# EAGLE design power_hub (EAGLE 9.6.2)
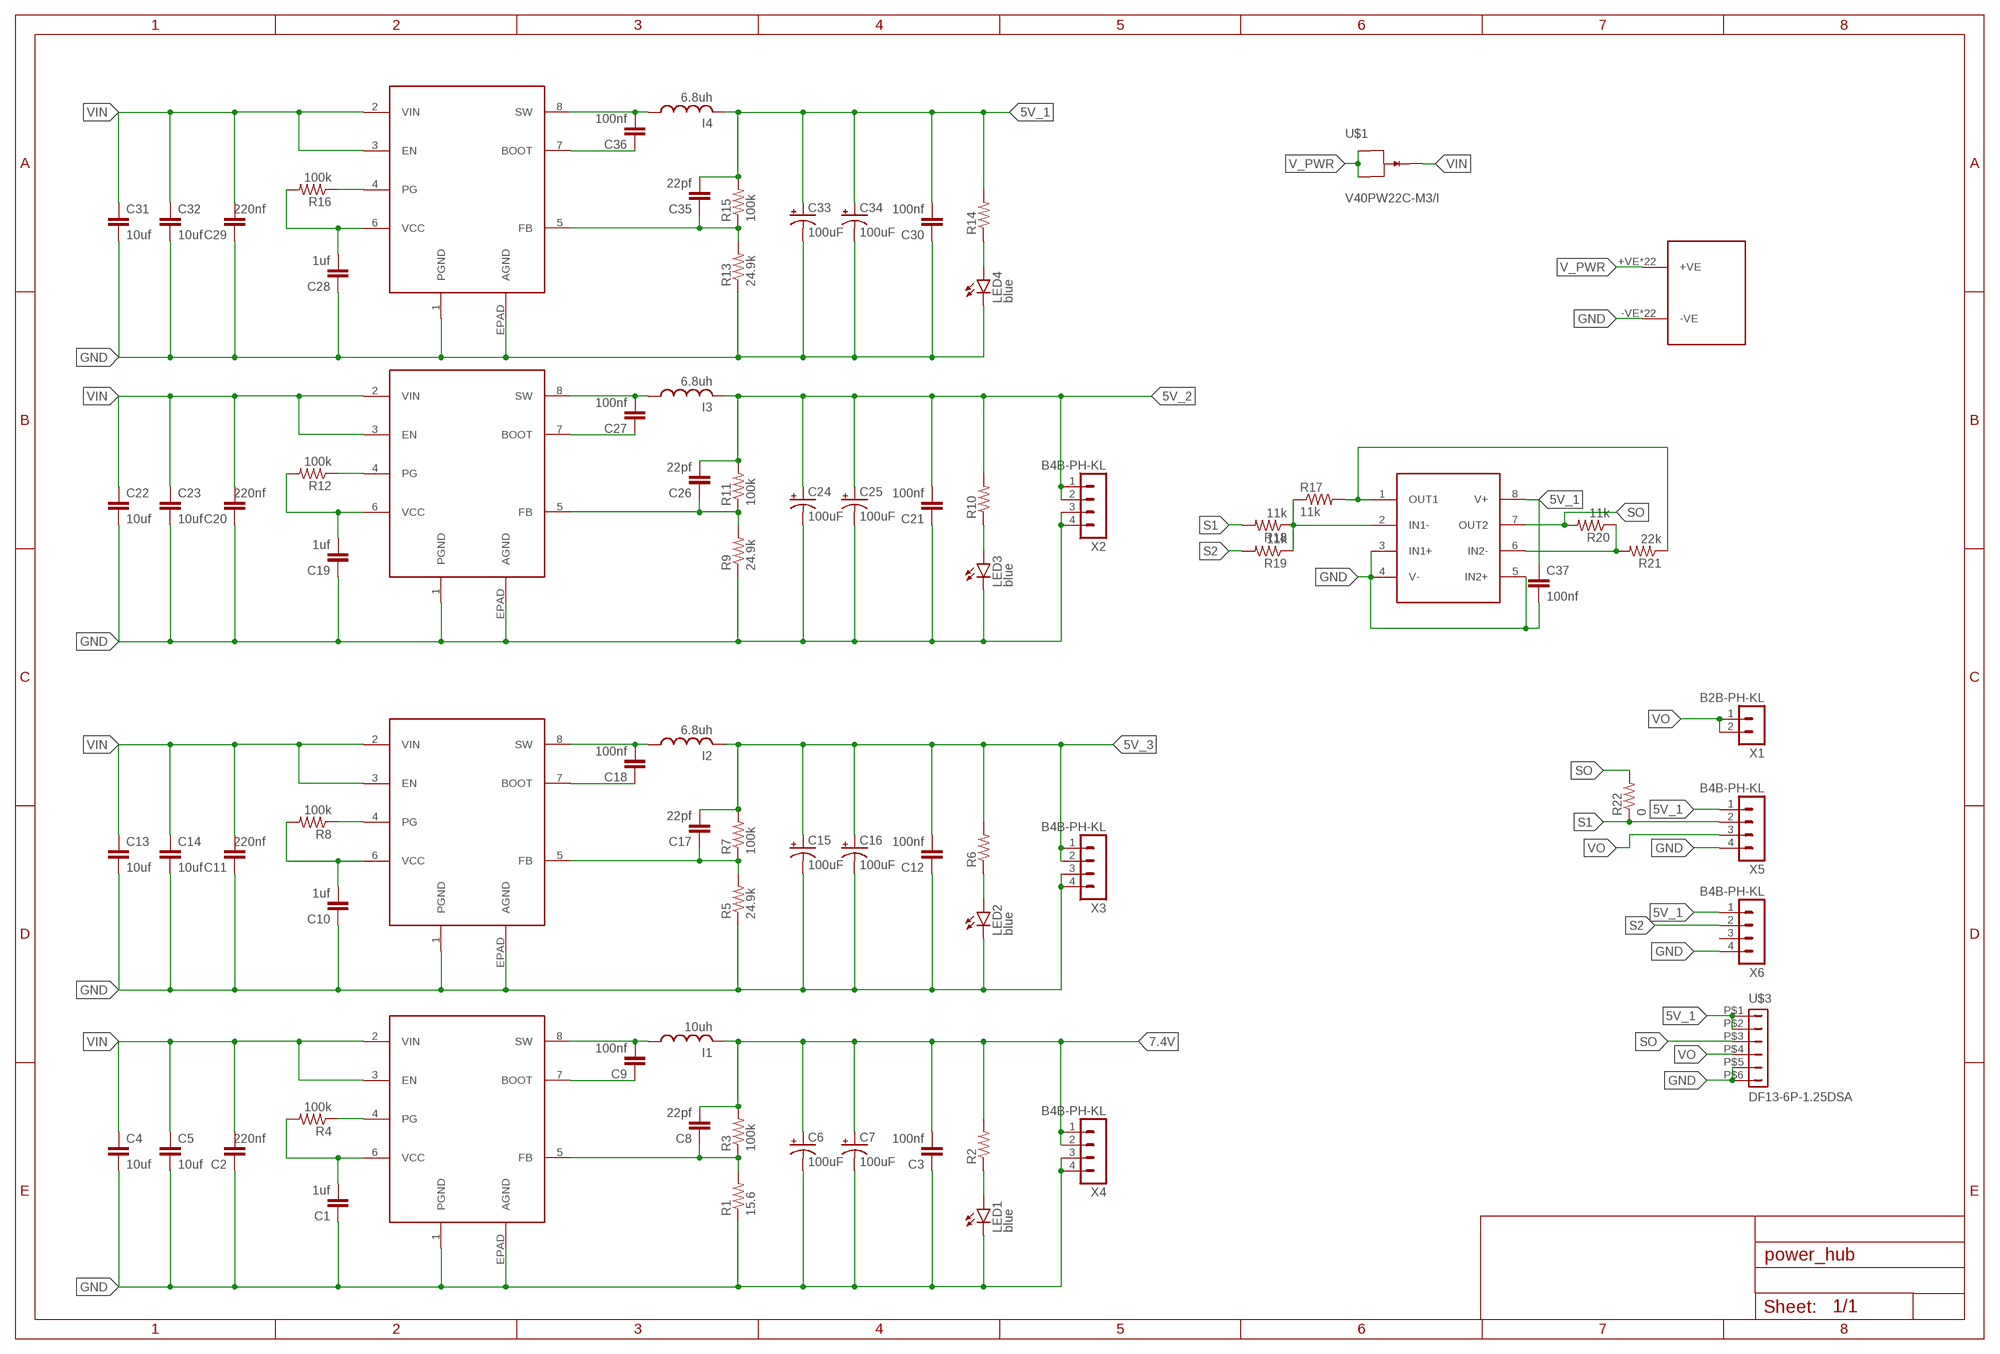
[diagram p0: schematic, sheet 1]

## Parts
C1  1uf  C-EUC0805  [C0805]
C2  220nf  C-EUC0805  [C0805]
C3  100nf  C-EUC0805  [C0805]
C4  10uf  C-EUC1210  [C1210]
C5  10uf  C-EUC1210  [C1210]
C6  100uF  100UF-POLAR-25V-20%(ELEC)  [PANASONIC_D]
C7  100uF  100UF-POLAR-25V-20%(ELEC)  [PANASONIC_D]
C8  22pf  C-EUC0805  [C0805]
C9  100nf  C-EUC0805  [C0805]
C10  1uf  C-EUC0805  [C0805]
C11  220nf  C-EUC0805  [C0805]
C12  100nf  C-EUC0805  [C0805]
C13  10uf  C-EUC1210  [C1210]
C14  10uf  C-EUC1210  [C1210]
C15  100uF  100UF-POLAR-25V-20%(ELEC)  [PANASONIC_D]
C16  100uF  100UF-POLAR-25V-20%(ELEC)  [PANASONIC_D]
C17  22pf  C-EUC0805  [C0805]
C18  100nf  C-EUC0805  [C0805]
C19  1uf  C-EUC0805  [C0805]
C20  220nf  C-EUC0805  [C0805]
C21  100nf  C-EUC0805  [C0805]
C22  10uf  C-EUC1210  [C1210]
C23  10uf  C-EUC1210  [C1210]
C24  100uF  100UF-POLAR-25V-20%(ELEC)  [PANASONIC_D]
C25  100uF  100UF-POLAR-25V-20%(ELEC)  [PANASONIC_D]
C26  22pf  C-EUC0805  [C0805]
C27  100nf  C-EUC0805  [C0805]
C28  1uf  C-EUC0805  [C0805]
C29  220nf  C-EUC0805  [C0805]
C30  100nf  C-EUC0805  [C0805]
C31  10uf  C-EUC1210  [C1210]
C32  10uf  C-EUC1210  [C1210]
C33  100uF  100UF-POLAR-25V-20%(ELEC)  [PANASONIC_D]
C34  100uF  100UF-POLAR-25V-20%(ELEC)  [PANASONIC_D]
C35  22pf  C-EUC0805  [C0805]
C36  100nf  C-EUC0805  [C0805]
C37  100nf  C-EUC0805  [C0805]
I1  10uh  INDUCTORINDUCTOR-1265  [INDUCTOR-1265]
I2  6.8uh  INDUCTORINDUCTOR-1265  [INDUCTOR-1265]
I3  6.8uh  INDUCTORINDUCTOR-1265  [INDUCTOR-1265]
I4  6.8uh  INDUCTORINDUCTOR-1265  [INDUCTOR-1265]
LED1  blue  LEDCHIPLED_0805  [CHIPLED_0805]
LED2  blue  LEDCHIPLED_0805  [CHIPLED_0805]
LED3  blue  LEDCHIPLED_0805  [CHIPLED_0805]
LED4  blue  LEDCHIPLED_0805  [CHIPLED_0805]
R1  15.6  R-US_R0805  [R0805]
R2  1k  R-US_R0805  [R0805]
R3  100k  R-US_R0805  [R0805]
R4  100k  R-US_R0805  [R0805]
R5  24.9k  R-US_R0805  [R0805]
R6  1k  R-US_R0805  [R0805]
R7  100k  R-US_R0805  [R0805]
R8  100k  R-US_R0805  [R0805]
R9  24.9k  R-US_R0805  [R0805]
R10  1k  R-US_R0805  [R0805]
R11  100k  R-US_R0805  [R0805]
R12  100k  R-US_R0805  [R0805]
R13  24.9k  R-US_R0805  [R0805]
R14  1k  R-US_R0805  [R0805]
R15  100k  R-US_R0805  [R0805]
R16  100k  R-US_R0805  [R0805]
R17  11k  R-US_R0805  [R0805]
R18  11k  R-US_R0805  [R0805]
R19  11k  R-US_R0805  [R0805]
R20  11k  R-US_R0805  [R0805]
R21  22k  R-US_R0805  [R0805]
R22  0  R-US_R0805  [R0805]
U1  LMR33640  [SO-POWERPAD8_DDA_TEX-M]
U2  LMR33640  [SO-POWERPAD8_DDA_TEX-M]
U3  LMR33640  [SO-POWERPAD8_DDA_TEX-M]
U4  LMR33640  [SO-POWERPAD8_DDA_TEX-M]
U$1  V40PW22C-M3/I  DIODE-TO252  [TO-252AE]
U$2  LM3588  [SOP-08]
U$3  DF13-6P-1.25DSA  [DF13-6P-1.25DSA]
U$4  CON_PAD  [MOTOR_PAD]
X1  B2B-PH-KL  [B2B-PH-K-S]
X2  B4B-PH-KL  [B4B-PH-K-S]
X3  B4B-PH-KL  [B4B-PH-K-S]
X4  B4B-PH-KL  [B4B-PH-K-S]
X5  B4B-PH-KL  [B4B-PH-K-S]
X6  B4B-PH-KL  [B4B-PH-K-S]

## Nets
5V_1: C30.2 C33.+ C34.+ C35.2 C37.1 I4.P$2 R14.2 R15.2 U$2.8(V+) U$3.P$1 U$3.P$2 X5.1 X6.1
5V_2: C21.2 C24.+ C25.+ C26.2 I3.P$2 R10.2 R11.2 X2.1 X2.2
5V_3: C12.2 C15.+ C16.+ C17.2 I2.P$2 R6.2 R7.2 X3.1 X3.2
7.4V: C3.2 C6.+ C7.+ C8.2 I1.P$2 R2.2 R3.2 X4.1 X4.2
GND: C1.1 C2.1 C3.1 C4.2 C5.2 C6.- C7.- C10.1 C11.1 C12.1 C13.2 C14.2 C15.- C16.- C19.1 C20.1 C21.1 C22.2 C23.2 C24.- C25.- C28.1 C29.1 C30.1 C31.2 C32.2 C33.- C34.- C37.2 LED1.C LED2.C LED3.C LED4.C R1.1 R5.1 R9.1 R13.1 U1.1(PGND) U1.EPAD(AGND) U2.1(PGND) U2.EPAD(AGND) U3.1(PGND) U3.EPAD(AGND) U4.1(PGND) U4.EPAD(AGND) U$2.3(IN1+) U$2.4(V-) U$2.5(IN2+) U$3.P$5 U$3.P$6 U$4.-VE U$4.-VE_1(-VE) U$4.V37(-VE) U$4.V38(-VE) U$4.V39(-VE) U$4.V40(-VE) U$4.V41(-VE) U$4.V42(-VE) U$4.V43(-VE) U$4.V44(-VE) U$4.V45(-VE) U$4.V46(-VE) U$4.V47(-VE) U$4.V48(-VE) U$4.V49(-VE) U$4.V50(-VE) U$4.V51(-VE) U$4.V52(-VE) U$4.V53(-VE) U$4.V54(-VE) U$4.V55(-VE) U$4.V56(-VE) X2.3 X2.4 X3.3 X3.4 X4.3 X4.4 X5.4 X6.4
N$1: R17.1 R18.1 R19.1 U$2.2(IN1-)
N$2: R20.1 R21.2 U$2.6(IN2-)
N$5: R17.2 R21.1 U$2.1(OUT1)
N$6: C36.1 U4.7(BOOT)
N$8: C36.2 I4.P$1 U4.8(SW)
N$9: C35.1 R13.2 R15.1 U4.5(FB)
N$10: C28.2 R16.2 U4.6(VCC)
N$11: R16.1 U4.4(PG)
N$12: LED4.A R14.1
N$13: C18.1 U2.7(BOOT)
N$14: C18.2 I2.P$1 U2.8(SW)
N$15: C17.1 R5.2 R7.1 U2.5(FB)
N$16: C10.2 R8.2 U2.6(VCC)
N$17: R8.1 U2.4(PG)
N$18: LED2.A R6.1
N$19: C27.1 U3.7(BOOT)
N$20: C27.2 I3.P$1 U3.8(SW)
N$21: C26.1 R9.2 R11.1 U3.5(FB)
N$22: C19.2 R12.2 U3.6(VCC)
N$23: R12.1 U3.4(PG)
N$24: LED3.A R10.1
N$25: C9.1 U1.7(BOOT)
N$26: C9.2 I1.P$1 U1.8(SW)
N$27: C8.1 R1.2 R3.1 U1.5(FB)
N$28: C1.2 R4.2 U1.6(VCC)
N$29: R4.1 U1.4(PG)
N$30: LED1.A R2.1
S1: R18.2 R22.1 X5.2
S2: R19.2 X6.2
SO: R20.2 R22.2 U$2.7(OUT2) U$3.P$3
V_PWR: U$1.P$2(A1) U$1.P$3(A2) U$4.+VE U$4.+VE_1(+VE) U$4.V7(+VE) U$4.V8(+VE) U$4.V9(+VE) U$4.V10(+VE) U$4.V11(+VE) U$4.V12(+VE) U$4.V13(+VE) U$4.V14(+VE) U$4.V15(+VE) U$4.V16(+VE) U$4.V17(+VE) U$4.V18(+VE) U$4.V19(+VE) U$4.V20(+VE) U$4.V21(+VE) U$4.V22(+VE) U$4.V23(+VE) U$4.V24(+VE) U$4.V25(+VE) U$4.V26(+VE)
VIN: C2.2 C4.1 C5.1 C11.2 C13.1 C14.1 C20.2 C22.1 C23.1 C29.2 C31.1 C32.1 U1.2(VIN) U1.3(EN) U2.2(VIN) U2.3(EN) U3.2(VIN) U3.3(EN) U4.2(VIN) U4.3(EN) U$1.P$1(K)
VO: U$3.P$4 X1.1 X1.2 X5.3
Unconnected: X6.3

## Library data of the parts
C1-C5 C8-C14 C17-C23 C26-C32 C35-C37 = rcl:C-EU: CAPACITOR, European symbol; SPICEPREFIX: C
C6 C7 C15 C16 C24 C25 C33 C34 = SparkFun-Capacitors:100UF-POLAR: 100µF polarized capacitors A capacitor is a passive two-terminal electrical component used to store electrical energy temporarily in an electric field.; PROD_ID: CAP-12547
I1-I4 = pcbV1:INDUCTOR
LED1-LED4 = led:LED: LED OSRAM: - CHIPLED LG R971, LG N971, LY N971, LG Q971, LY Q971, LO R971, LY R971 LH N974, LH R974 LS Q976, LO Q976, LY Q976 LO Q996 - Hyper CHIPLED LW Q18S LB Q993, LB Q99A, LB R99A - SideLED LS A670, LO A670, LY A670, LG A670, LP A670 LB A673, LV A673, LT A673, LW A673 LH A674 LY A675 LS A676, LA A676, LO A676, LY A676, LW A676 LS A679, LY A679, LG A679 - Hyper Micro SIDELED® LS Y876, LA Y876, LO Y876, LY Y876 LT Y87S - SmartLED LW L88C, LW L88S LB L89C, LB L89S, LG L890 LS L89K, LO L89K, LY L89K LS L896, LA L896, LO L896, LY L896 - TOPLED LS T670, LO T670, LY T670, LG T670, LP T670 LSG T670, LSP T670, LSY T670, LOP T670, LYG T670 LG T671, LOG T671, LSG T671 LB T673, LV T673, LT T673, LW T673 LH T674 LS T676, LA T676, LO T676, LY T676, LB T676, LH T676, LSB T676, LW T676 LB T67C, LV T67C, LT T67C, LS T67K, LO T67K, LY T67K, LW E67C LS E67B, LA E67B, LO E67B, LY E67B, LB E67C, LV E67C, LT E67C LW T67C LS T679, LY T679, LG T679 LS T770, LO T770, LY T770, LG T770, LP T770 LB T773, LV T773, LT T773, LW T773 LH T774 LS E675, LA E675, LY E675, LS T675 LS T776, LA T776, LO T776, LY T776, LB T776 LHGB T686 LT T68C, LB T68C - Hyper Mini TOPLED® LB M676 - Mini TOPLED Santana® LG M470 LS M47K, LO M47K, LY M47K Source: http://www.osram.convergy.de LUXEON: - LUMILED® LXK2-PW12-R00, LXK2-PW12-S00, LXK2-PW14-U00, LXK2-PW14-V00 LXK2-PM12-R00, LXK2-PM12-S00, LXK2-PM14-U00 LXK2-PE12-Q00, LXK2-PE12-R00, LXK2-PE12-S00, LXK2-PE14-T00, LXK2-PE14-U00 LXK2-PB12-K00, LXK2-PB12-L00, LXK2-PB12-M00, LXK2-PB14-N00, LXK2-PB14-P00, LXK2-PB14-Q00 LXK2-PR12-L00, LXK2-PR12-M00, LXK2-PR14-Q00, LXK2-PR14-R00 LXK2-PD12-Q00, LXK2-PD12-R00, LXK2-PD12-S00 LXK2-PH12-R00, LXK2-PH12-S00 LXK2-PL12-P00, LXK2-PL12-Q00, LXK2-PL12-R00 Source: www.luxeon.com KINGBRIGHT: KA-3528ASYC Source: www.kingbright.com
R1-R22 = rcl:R-US_: RESISTOR, American symbol; SPICEPREFIX: R
U1-U4 = LMR33640:LMR33640
U$1 = diode-to252:DIODE-TO252
U$2 = LM358:LM3588
U$3 = con-hirose-df13:DF13-6P-1.25: DF13-6P 1.25mm Pitch Miniature Crimping Connector.
U$4 = power_pad:CON_PAD
X1 = con-JST PH:B2B-PH: JST PH series header 2.00mm pitch disconnectable crimp style connectors, vertical (side entry type), 2 pins
X2-X6 = con-JST PH:B4B-PH: JST PH series header 2.00mm pitch disconnectable crimp style connectors, vertical (side entry type), 4 pins

## Board
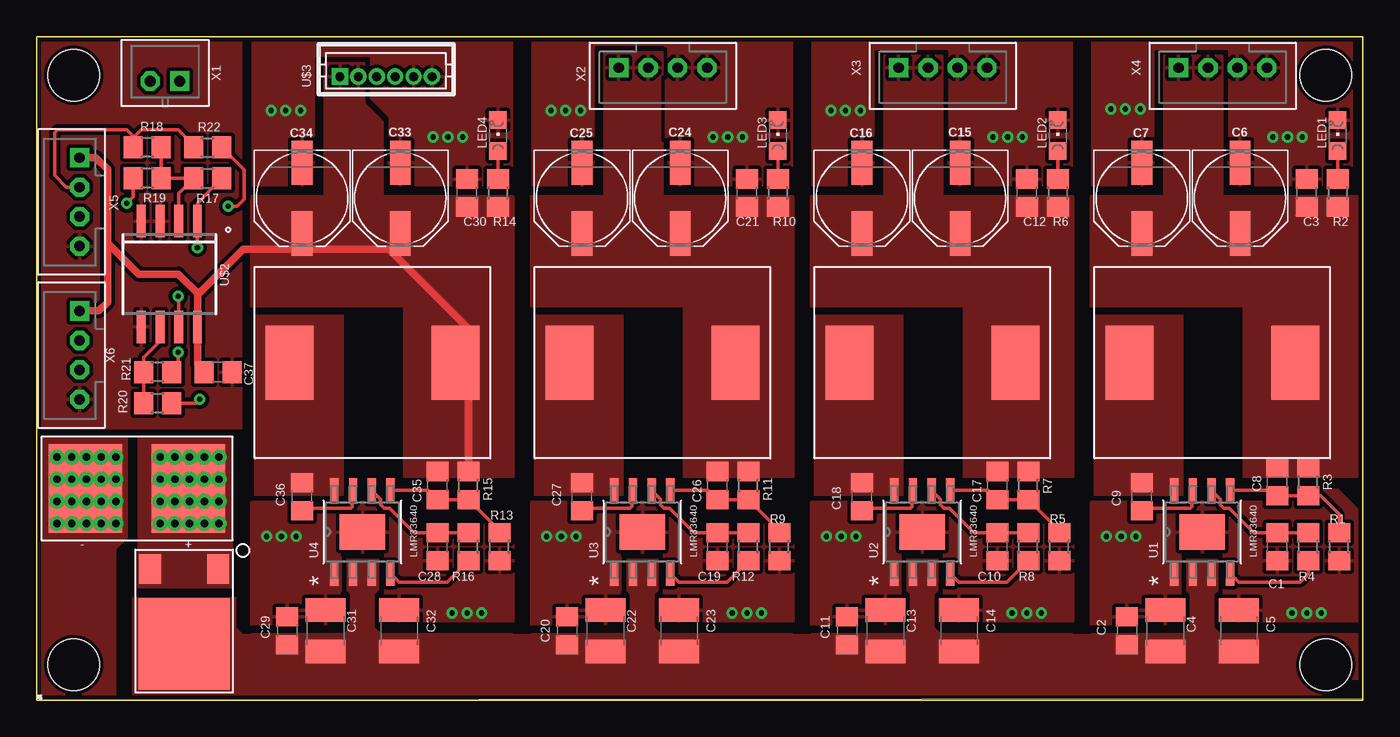
[diagram p1: board, top side]
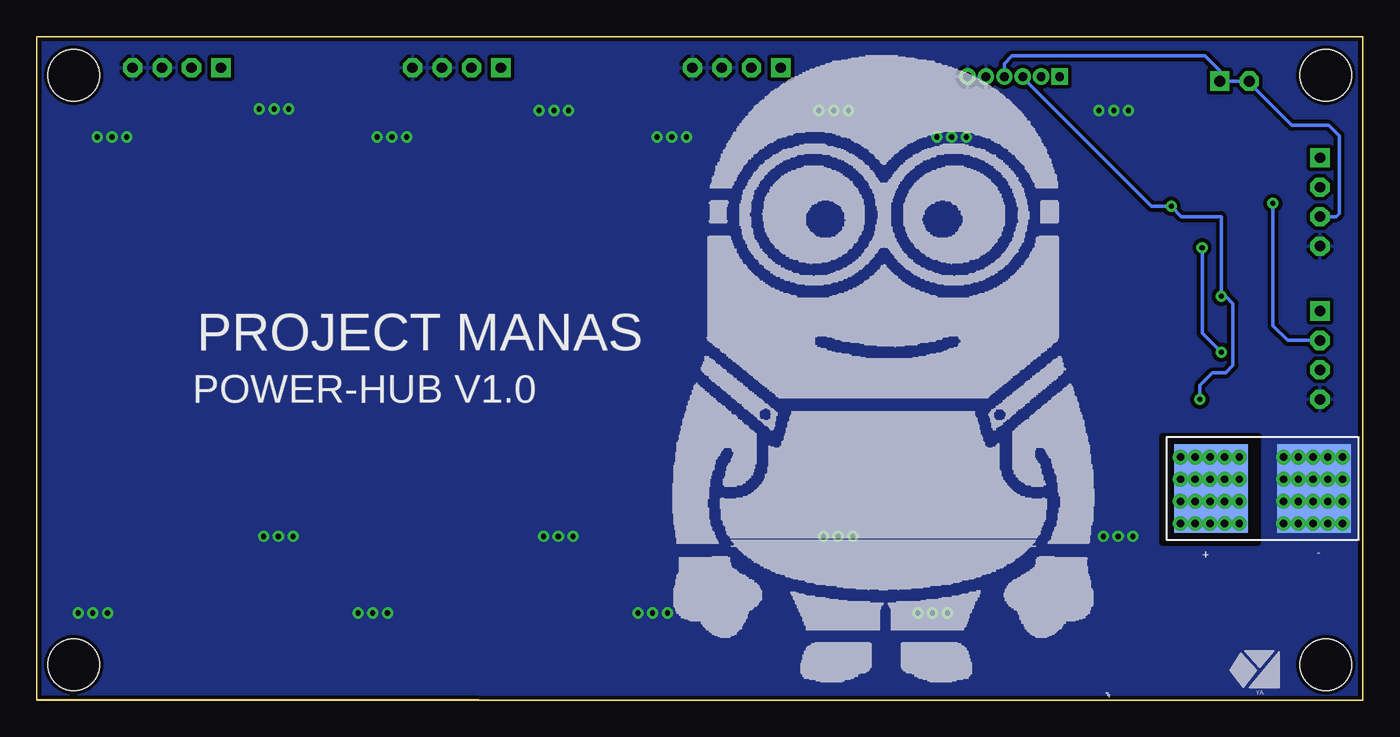
[diagram p2: board, bottom side, seen from below]

Size 90 x 45 mm. Coordinates in mm from the lower left corner, seen from the top.
Outline: 90,0.1 0,0
Outline: 0,0 90,0 90,45 0,45 0,0
Copper layers (1*16): Top 0.035mm / dielectric 1.5mm / Bottom 0.035mm
Design rules "default *": minimum track width 0.25mm, minimum drill 0.35mm, track to track 10mil, track to pad 10mil, pad to pad 10mil, via to via 6mil, smd to smd 6mil, copper to edge 10mil, drill to drill 6mil, minimum pad ring 10mil, minimum via ring 8mil, stop-mask expansion 4mil, vias tented up to drill 0mil, thermal gap 10mil
Holes 3.5 mm at 87.5,2.4 87.5,42.4 2.5,42.4 2.5,2.4
tRestrict: 17 lines
bRestrict: 4 lines

### Footprints (pad centres in the part's own frame; a part is rotated, then mirrored left to right if it is on the bottom)
C0805 = smd 1.3 x 1.5: 1 -0.95,0; 2 0.95,0
C1210 = smd 1.6 x 2.7: 1 -1.4,0; 2 1.4,0
PANASONIC_D = smd 3 x 1.4: + 2.4,0; - -2.4,0
INDUCTOR-1265 = smd 3.25 x 5: P$1 5.625,0; P$2 -5.625,0
CHIPLED_0805 = smd 1.2 x 1.2: A 0,-1.05; C 0,1.05
R0805 = smd 1.3 x 1.5: 1 -0.95,0; 2 0.95,0
SO-POWERPAD8_DDA_TEX-M = smd 1.664 x 0.559: 1 -2.826,1.905; 2 -2.826,0.635; 3 -2.826,-0.635; 4 -2.826,-1.905; 5 2.826,-1.905; 6 2.826,-0.635; 7 2.826,0.635; 8 2.826,1.905 | smd 2.388 x 3.099: EPAD 0,0
TO-252AE = smd 6.2 x 6.2: P$1 0,3.1 | smd 1.5 x 2: P$2 -2.3,-2; P$3 2.3,-2
SOP-08 = smd 0.6 x 2.2: 1 -1.905,-3.6; 2 -0.635,-3.6; 3 0.635,-3.6; 4 1.905,-3.6; 5 1.905,3.575; 6 0.635,3.575; 7 -0.635,3.575; 8 -1.905,3.575
DF13-6P-1.25DSA = drill 0.6 pad 1.016 square: P$1 3.125,0 | drill 0.6 pad 1.016: P$2 1.875,0; P$3 0.625,0; P$4 -0.625,0; P$5 -1.875,0; P$6 -3.125,0
MOTOR_PAD = smd 5 x 6: +VE -3.5,0; -VE 3.5,0 | smd 5 x 6 bottom: +VE_1 -3.5,0; -VE_1 3.5,0 | drill 0.5 pad 0.8: V7 -5.57,2.37; V8 -4.57,2.37; V9 -3.57,2.37; V10 -2.57,2.37; V11 -1.57,2.37; V12 -5.57,0.87; V13 -4.57,0.87; V14 -3.57,0.87; V15 -2.57,0.87; V16 -1.57,0.87; V17 -1.57,-0.63; V18 -2.57,-0.63; V19 -3.57,-0.63; V20 -4.57,-0.63; V21 -5.57,-0.63; V22 -5.57,-2.13; V23 -4.57,-2.13; V24 -3.57,-2.13; V25 -2.57,-2.13; V26 -1.57,-2.13; V37 1.43,2.37; V38 2.43,2.37; V39 3.43,2.37; V40 4.43,2.37; V41 5.43,2.37; V42 1.43,0.87; V43 2.43,0.87; V44 3.43,0.87; V45 4.43,0.87; V46 5.43,0.87; V47 5.43,-0.63; V48 4.43,-0.63; V49 3.43,-0.63; V50 2.43,-0.63; V51 1.43,-0.63; V52 1.43,-2.13; V53 2.43,-2.13; V54 3.43,-2.13; V55 4.43,-2.13; V56 5.43,-2.13
B2B-PH-K-S = drill 0.75 pad 1.3 square: 1 1,0 | drill 0.75 pad 1.3 octagon: 2 -1,0
B4B-PH-K-S = drill 0.7 pad 1.3 square: 1 3,0 | drill 0.7 pad 1.3 octagon: 2 1,0; 3 -1,0; 4 -3,0

### Placement (x,y rotation side)
C1  84.2,10.4 90 top
C2  74,4.7 270 top
C3  86.2,34.4 270 top
C4  76.6,4.7 90 top
C5  81.6,4.7 90 top
C6  81.67,34.05 270 top
C7  75.01,34.05 270 top
C8  84.2,14.8 90 top
C9  75,13.8 90 top
C10  65.2,10.4 90 top
C11  55,4.7 270 top
C12  67.2,34.4 270 top
C13  57.6,4.7 90 top
C14  62.6,4.7 90 top
C15  62.67,34.05 270 top
C16  56.01,34.05 270 top
C17  65.2,14.55 90 top
C18  56,13.8 90 top
C19  46.2,10.4 90 top
C20  36,4.7 270 top
C21  48.2,34.4 270 top
C22  38.6,4.7 90 top
C23  43.6,4.7 90 top
C24  43.67,34.05 270 top
C25  37.01,34.05 270 top
C26  46.2,14.55 90 top
C27  37,13.8 90 top
C28  27.2,10.4 90 top
C29  17,4.7 270 top
C30  29.2,34.4 270 top
C31  19.6,4.7 90 top
C32  24.6,4.7 90 top
C33  24.67,34.05 270 top
C34  18.01,34.05 270 top
C35  27.2,14.55 90 top
C36  18,13.8 90 top
C37  12.3,22.25 0 top
I1  79.79,22.89 180 top
I2  60.79,22.89 180 top
I3  41.79,22.89 180 top
I4  22.79,22.89 180 top
LED1  88.3,38.3 0 top
LED2  69.3,38.3 0 top
LED3  50.3,38.3 0 top
LED4  31.3,38.3 0 top
R1  88.4,10.4 90 top
R2  88.3,34.4 270 top
R3  86.3,14.8 90 top
R4  86.3,10.4 90 top
R5  69.4,10.4 90 top
R6  69.3,34.4 270 top
R7  67.3,14.55 90 top
R8  67.3,10.4 90 top
R9  50.4,10.4 90 top
R10  50.3,34.4 270 top
R11  48.3,14.55 90 top
R12  48.3,10.4 90 top
R13  31.4,10.4 90 top
R14  31.3,34.4 270 top
R15  29.3,14.55 90 top
R16  29.3,10.4 90 top
R17  11.6,35.4 0 top
R18  7.5,37.5 180 top
R19  7.5,35.4 180 top
R20  8.2,20.15 0 top
R21  8.2,22.25 180 top
R22  11.6,37.5 0 top
U1  79.1,11.4 90 top
U2  60.1,11.4 90 top
U3  41.1,11.4 90 top
U4  22.1,11.4 90 top
U$1  10,6.9 180 top
U$2  9,28.9 180 top
U$3  23.7,42.3 180 top
U$4  6.8,14.35 180 top
X1  8.7,42 0 top
X2  42.5,42.9 180 top
X3  61.5,42.9 180 top
X4  80.5,42.9 180 top
X5  2.9,33.8 90 top
X6  2.9,23.4 90 top

### Tracks (layer width: path | path; a pad name or v marks a point on that pad's centre or on a via)
5V_1
  Top 0.5: X5.1 4,36.8 4.8,36 4.8,31 | X6.1 4.2,26.4 4.8,27 4.8,31 | 4.8,31 6.9,28.9 9.6,28.9 10.9,27.59 10.9,27.5 | R15.2 29.3,25.2 23.9,30.6 14,30.6 10.9,27.5 | C37.1 10.9,22.8 U$2.8 10.9,27.5
  pour Top (no thermals): 14.5,34.2 32.3,34.2 32.4,34.1 32.4,15.1 24.9,15.1 24.9,26.7 14.5,26.7
  pour Top: 22.25,43.25 22.25,40.5 23.5,39.25 23.5,34 19.5,34 19.5,43.25
5V_2
  pour Top (no thermals): 33.5,34.2 51.3,34.2 51.4,34.1 51.4,15.1 43.9,15.1 43.9,26.7 33.5,26.7
  pour Top: 42.5,44 38.5,44 38.5,34 42.5,34
5V_3
  pour Top (no thermals): 52.5,34.2 70.3,34.2 70.4,34.1 70.4,15.1 62.9,15.1 62.9,26.7 52.5,26.7
  pour Top: 61.5,43.75 61.5,33.75 57.5,33.75 57.5,43.75
7.4V
  pour Top (no thermals): 71.5,34.2 89.7,34.2 89.9,34 89.9,15.1 81.9,15.1 81.9,26.7 71.5,26.7
  pour Top: 80.5,42.75 80.5,33.75 76.5,33.75 76.5,43.75 80.5,43.75
GND  (via drill 0.35)
  other vias: 26.9,38.2 27.9,38.2 28.9,38.2 28.2,5.9 29.2,5.9 30.2,5.9 15.6,11.1 16.6,11.1 17.6,11.1 45.9,38.2 46.9,38.2 47.9,38.2 47.2,5.9 48.2,5.9 49.2,5.9 34.6,11.1 35.6,11.1 36.6,11.1 64.9,38.2 65.9,38.2 66.9,38.2 66.2,5.9 67.2,5.9 68.2,5.9 53.6,11.1 54.6,11.1 55.6,11.1 83.9,38.2 84.9,38.2 85.9,38.2 85.2,5.9 86.2,5.9 87.2,5.9 72.6,11.1 73.6,11.1 74.6,11.1 15.9,40 16.9,40 17.9,40 34.9,40 35.9,40 36.9,40 53.9,40 54.9,40 55.9,40 74.9,40.1 73.9,40.1 72.9,40.1
  pour Top: 14.6,13.5 26.4,13.5 27.2,14.3 32.3,14.3 32.4,14.2 32.4,5.3 23.6,5.3 23.6,9.95 20.6,9.95 20.6,5.1 14.5,5.1 14.5,13.4
  pour Top (rank 2): 14.6,44.9 14.6,34.9 32.3,34.9 32.3,44.9
  pour Bottom: 0.2,44.9 89.9,44.9 89.9,-0.1 0.2,-0.1
  pour Top (no thermals): 20.65,7.4 19.5,7.4 19.5,9.7 20.65,9.7
  pour Top: 33.6,13.5 45.4,13.5 46.2,14.3 51.3,14.3 51.4,14.2 51.4,5.3 42.55,5.3 42.55,9.95 39.6,9.95 39.6,5.1 33.5,5.1 33.5,13.4
  pour Top (rank 2): 33.6,44.9 33.6,34.9 51.3,34.9 51.3,44.9
  pour Top (no thermals): 39.65,7.4 38.5,7.4 38.5,9.7 39.65,9.7
  pour Top: 52.6,13.5 64.4,13.5 65.2,14.3 70.3,14.3 70.4,14.2 70.4,5.3 61.55,5.3 61.55,9.95 58.65,9.95 58.65,5.1 52.5,5.1 52.5,13.4
  pour Top (rank 2): 52.6,44.8 52.6,34.9 70.3,34.9 70.3,44.8
  pour Top (no thermals): 58.65,7.4 57.5,7.4 57.5,9.7 58.65,9.7
  pour Top: 71.6,13.5 83.4,13.5 84.2,14.3 88.3,14.3 89.9,12.7 89.9,5.3 80.55,5.3 80.55,10 77.65,10 77.65,5.1 71.5,5.1 71.5,13.4
  pour Top (rank 2): 71.6,44.8 71.6,34.9 89.3,34.9 89.3,44.8
  pour Top (no thermals): 77.65,7.4 76.5,7.4 76.5,9.7 77.65,9.7
  pour Top: 0.3,44.7 13.9,44.7 13.9,43 13.9,18.4 0.2,18.4 0.2,44.7
  pour Top (no thermals): 6.05,17.8 6.05,11 5.3,10.25 5.3,0.35 0.35,0.35 0.3,0.4 0.3,17.8
  pour Bottom (no thermals): 0.3,17.85 6.25,17.85 6.25,10.8 0.3,10.8
N$1
  Top 0.25: R18.1 R19.1 R17.1 9.63,34.38 U$2.2
N$2
  Top 0.25: R20.1 R21.2 7.25,23.25 8.37,24.36 U$2.6
N$5  (via drill 0.35)
  Top 0.25: R21.1 9.6,22.7 v9.6,23.6 | v10.9,30.7 U$2.1 10.9,33.72 11.68,34.49 11.68,34.53 R17.2
  Bottom 0.25: v9.6,23.6 10.9,24.9 v10.9,30.7
N$6
  Top 0.25: U4.7 21.4,14.16 21.4,13.1 21.3,13 18.05,13 C36.1
N$8
  pour Top (no thermals): 14.8,26.1 14.8,13.9 20.8,13.9 20.8,26.1
N$9
  Top 0.25: U4.5 26.57,14.23 C35.1 R15.1 31.4,11.5 R13.2
N$10
  Top 0.25: U4.6 23.35,13.61 23.35,13.24 23.57,13.02 23.95,13.02 25.61,11.35 C28.2 R16.2
N$11
  Top 0.25: R16.1 27.85,8 24.58,8 U4.4
N$12
  Top 0.25: R14.1 LED4.A
N$13
  Top 0.25: U2.7 59.4,14.16 59.4,13.1 59.3,13 56.05,13 C18.1
N$14
  pour Top (no thermals): 52.8,26.1 52.8,13.9 58.8,13.9 58.8,26.1
N$15
  Top 0.25: U2.5 64.57,14.23 C17.1 R7.1 69.4,11.5 R5.2
N$16
  Top 0.25: U2.6 61.35,13.61 61.35,13.24 61.57,13.02 61.95,13.02 63.61,11.35 C10.2 R8.2
N$17
  Top 0.25: R8.1 65.85,8 62.58,8 U2.4
N$18
  Top 0.25: R6.1 LED2.A
N$19
  Top 0.25: U3.7 40.4,14.16 40.4,13.15 40.25,13 37.05,13 C27.1
N$20
  pour Top (no thermals): 33.8,26.1 33.8,13.9 39.8,13.9 39.8,26.1
N$21
  Top 0.25: U3.5 45.57,14.23 C26.1 R11.1 50.4,11.5 R9.2
N$22
  Top 0.25: U3.6 42.35,13.61 42.35,13.24 42.57,13.02 42.95,13.02 44.61,11.35 C19.2 R12.2
N$23
  Top 0.25: R12.1 46.85,8 43.58,8 U3.4
N$24
  Top 0.25: R10.1 LED3.A
N$25
  Top 0.25: U1.7 78.4,14.16 78.4,13.1 78.3,13 75.05,13 C9.1
N$26
  pour Top (no thermals): 71.8,26.1 71.8,13.9 77.8,13.9 77.8,26.1
N$27
  Top 0.25: U1.5 83.87,14.23 C8.1 R3.1 87.15,13.85 88.4,12.6 R1.2
N$28
  Top 0.25: R4.2 C1.2 82.61,11.35 80.95,13.02 80.57,13.02 80.35,13.24 80.35,13.61 U1.6
N$29
  Top 0.25: R4.1 86.3,8.55 85.75,8 81.58,8 U1.4
N$30
  Top 0.25: R2.1 LED1.A
S1
  Top 0.25: R22.1 10.66,37.64 9.6,38.7 7.1,38.7 6.65,38.25 | R18.2 6.65,38.25 | 6.65,38.25 6.55,38.25 6.1,38.7 1.4,38.7 1.2,38.5 1.2,35.6 2,34.8 X5.2
S2  (via drill 0.35)
  Top 0.25: R19.2 6.55,34.15 v6.1,33.7
  Bottom 0.25: v6.1,33.7 6.1,25.4 5.1,24.4 X6.2
SO  (via drill 0.35)
  Top 0.25: v11.05,20.4 10.8,20.15 R20.2 | v9.6,27.4 9.63,27.36 U$2.7 | v13,33.5 13.59,33.5 14.08,33.99 14.08,35.97 R22.2
  Bottom 0.25: v11.05,20.4 11.05,21.35 10.2,22.2 9.3,22.2 8.8,22.7 8.8,26.9 9.3,27.4 v9.6,27.4 9.6,32.8 12.3,32.8 v13,33.5 14.34,33.5 22.76,41.91 22.76,41.98 U$3.P$3
V_PWR  (1 unrouted)
  pour Top (no thermals): 6.95,17.8 6.95,7.7 13.2,7.7 13.2,17.8
VIN
  pour Top (no thermals): 21.05,9.55 23.2,9.55 23.2,7.5 22.9,7.2 22.9,4.9 23.3,4.5 32.3,4.5 32.3,1.5 32.2,1.4 14.7,1.4 14.5,1.6 14.5,4.4 14.6,4.5 20.9,4.5 21.3,4.9 21.3,7.2 21.05,7.45
  pour Top (no thermals): 40.05,9.55 42.15,9.55 42.15,7.45 41.9,7.2 41.9,4.9 42.3,4.5 51.3,4.5 51.3,1.5 51.2,1.4 33.7,1.4 33.5,1.6 33.5,4.4 33.6,4.5 39.9,4.5 40.3,4.9 40.3,7.2 40.05,7.45
  pour Top (no thermals): 59.05,9.55 61.15,9.55 61.15,7.45 60.9,7.2 60.9,4.9 61.3,4.5 70.3,4.5 70.3,1.5 70.2,1.4 52.7,1.4 52.5,1.6 52.5,4.4 52.6,4.5 58.9,4.5 59.3,4.9 59.3,7.2 59.05,7.45
  pour Top (no thermals): 78.05,9.55 80.15,9.55 80.15,7.45 79.9,7.2 79.9,4.9 80.3,4.5 89.8,4.5 89.8,3 89.8,2 89.2,1.4 71.7,1.4 71.5,1.6 71.5,4.4 71.6,4.5 77.9,4.5 78.3,4.9 78.3,7.2 78.05,7.45
  pour Top: 14.5,4.4 14.5,1.4 90,1.4 90,4.4
  pour Top (no thermals): 6.5,6.9 6.5,-0.1 89.7,-0.1 89.7,4.4 14,4.4 13.5,4.9 13.5,6.9
VO
  Bottom 0.25: U$3.P$4 24.32,43.17 23.8,43.7 10.7,43.7 9.7,42.7 X1.1 7.8,42 | 7.8,42 X1.2 | X5.3 1.8,32.8 1.6,33 1.6,38.3 2.3,39 4.8,39 7.8,42

### Text on the board
tPlace: C:/Users/yatha/Desktop/toothless.bmp
tNames: - | +
bNames: PROJECT MANAS | POWER-HUB V1.0 | - | + | YA